# Altium schematic sheet ADC-LOGIC LEVEL CONVERTERS.SchDoc: <SPECIFIC SHEET FUNCTION>
size A3; Date: DO NOT USE, RATHER USE PROJ OPTIONS; DrawnBy: DO NOT USE, RATHER USE PROJ OPTIONS; Engineer: DO NOT USE, RATHER USE PROJ OPTIONS; Organization: DO NOT USE, RATHER USE PROJ OPTIONS; DocumentNumber: 8; Revision: DO NOT USE, RATHER USE PROJ OPTIONS; SheetNumber: 8; SheetTotal: 12; SCH_Sheet_Filename: ADC-LOGIC LEVEL CONVERTERS.SchDoc; CurrentTime: DO NOT USE, RATHER USE PROJ OPTIONS; Time: DO NOT USE, RATHER USE PROJ OPTIONS; DocumentFullPathAndName: DO NOT USE, RATHER USE PROJ OPTIONS; DocumentName: DO NOT USE, RATHER USE PROJ OPTIONS; ModifiedDate: DO NOT USE, RATHER USE PROJ OPTIONS; ImagePath: DO NOT USE, RATHER USE PROJ OPTIONS
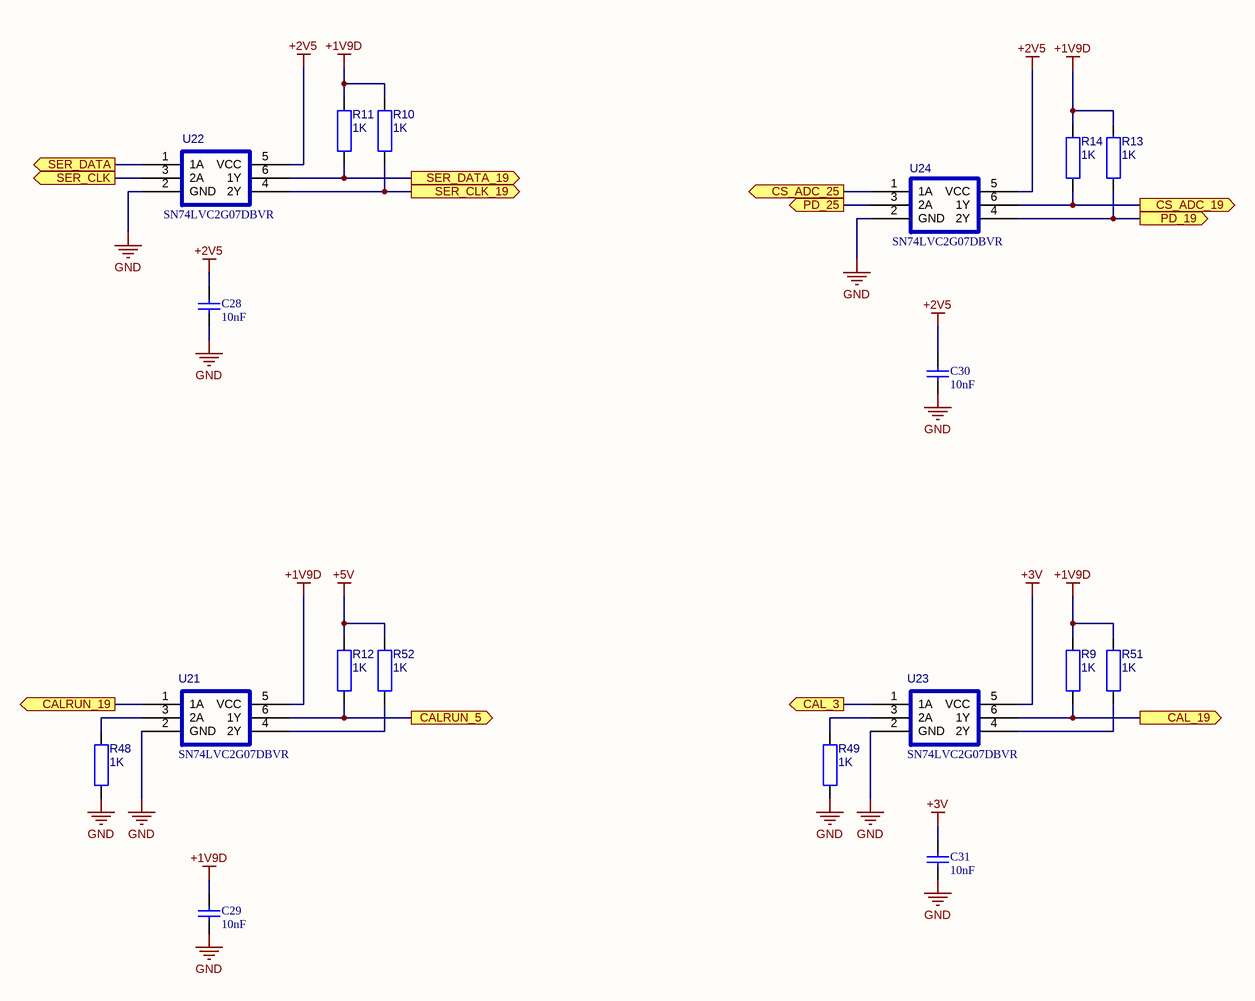
[diagram p0: ADC-LOGIC LEVEL CONVERTERS.SchDoc]

## Parts
C28  value 10nF  [CAPC1005X55N]  (hidden comment: Capacitor 0402 SMD)
C29  value 10nF  [CAPC1005X55N]  (hidden comment: Capacitor 0402 SMD)
C30  value 10nF  [CAPC1005X55N]  (hidden comment: Capacitor 0402 SMD)
C31  value 10nF  [CAPC1005X55N]  (hidden comment: Capacitor 0402 SMD)
R9  1K  [0603]
R10  1K  [0603]
R11  1K  [0603]
R12  1K  [0603]
R13  1K  [0603]
R14  1K  [0603]
R48  1K  [0603]
R49  1K  [0603]
R51  1K  [0603]
R52  1K  [0603]
U21  SN74LVC2G07DBVR  [SOT95P280X145-6N]
U22  SN74LVC2G07DBVR  [SOT95P280X145-6N]
U23  SN74LVC2G07DBVR  [SOT95P280X145-6N]
U24  SN74LVC2G07DBVR  [SOT95P280X145-6N]

## Ports
CAL_3 (out), CAL_19 (out), CALRUN_5 (out), CALRUN_19 (out), CS_ADC_19 (out), CS_ADC_25 (out), PD_19 (out), PD_25 (out), SER_CLK (out), SER_CLK_19 (out), SER_DATA (out), SER_DATA_19 (out)

## Nets
+1V9D: C29.2 R9.1 R10.1 R11.1 R13.1 R14.1 R51.1 U21.5(VCC)
+2V5: C28.2 C30.2 U22.5(VCC) U24.5(VCC)
+3V: C31.2 U23.5(VCC)
+5V: R12.1 R52.1
GND: C28.1 C29.1 C30.1 C31.1 R48.2 R49.2 U21.2(GND) U22.2(GND) U23.2(GND) U24.2(GND)
CAL_3: U23.1(1A) ; port CAL_3
CAL_19: R9.2 U23.6(1Y) ; port CAL_19
CALRUN_5: R12.2 U21.6(1Y) ; port CALRUN_5
CALRUN_19: U21.1(1A) ; port CALRUN_19
CS_ADC_19: R14.2 U24.6(1Y) ; port CS_ADC_19
CS_ADC_25: U24.1(1A) ; port CS_ADC_25
PD_19: R13.2 U24.4(2Y) ; port PD_19
PD_25: U24.3(2A) ; port PD_25
SER_CLK: U22.3(2A) ; port SER_CLK
SER_CLK_19: R10.2 U22.4(2Y) ; port SER_CLK_19
SER_DATA: U22.1(1A) ; port SER_DATA
SER_DATA_19: R11.2 U22.6(1Y) ; port SER_DATA_19
NetR48_1: R48.1 U21.3(2A)
NetR49_1: R49.1 U23.3(2A)
NetR51_2: R51.2 U23.4(2Y)
NetR52_2: R52.2 U21.4(2Y)

## Notes on the sheet
- 2009   THIS DOCUMENT IS THE PROPERTY OF THE OWNER, AND MAY NOT BE COPIED OR USED FOR ANY PURPOSE OTHER THAN THAT FOR WHICH IT IS SUPPLIED WITHOUT PERMISSION IN WRITING FROM THE OWNER.
- C
- DATESTAMP OF THIS PRINT
- DRAWN BY:
- DOCUMENT NUMBER:
- SCHEMATIC FILENAME:
- PCB FILENAME:
- ENGINEER:
- APPROVED:
- CIRCUIT DIAGRAM
- DATE
- SHEET
- REVISION
- OF

## Library data of the parts
C28-C31 = cap0402: Created_By: EDA-ASA; Checked_By: *; Checked_Date: *; HelpURL: *; Supplier1: *; Supplier2: *; Unit_Cost: *; MOQ: *; Leadtime: *; Inventory_Stock: *; Tolerance: *; Wattage: *; Package: 0402; ComponentLinked1Description: *; ComponentLinked1URL: *; ComponentLinked2Description: *; ComponentLinked2URL: *; ComponentLinked3Description: *; ComponentLinked3URL: *; ComponentLinked4Description: *; ComponentLinked4URL: *
R9-R14 R48 R49 R51 R52 = RES-0805: RESISTOR SMD 0805; Checked_By: NN; Manufacturer: *; Manufacturer_PN: *; Created_By: *; Checked_Date: 5-08-2009; HelpURL: *; ComponentLink1Description: Footprint Detail; ComponentLink1URL: *; ComponentLink2Description: Application Note; ComponentLink2URL: *; ComponentLink3Description: Layout Guidelines; ComponentLink3URL: *; ComponentLink4Description: Technology Reference; ComponentLink4URL: *; Supplier1: *; Supplier2: *; Unit_Cost: *; MOQ: *; Leadtime: *; Inventory_Stock: *; Tolerance: *; Wattage: *; Voltage: *; Package: 0805; ComponentLink5Description: Production Detail; ComponentLink5URL: *; Note: *; Stock Code: *; Value: 1K
U21-U24 = SN74LVC2G07DBVR: Dual Buffer/Driver with open-drain output; Manufacturer: TI; Created_By: IN; Manufacturer_PN: SN74LVC2G07DBVR; Checked_By: *; Checked_Date: *; HelpURL: X:\Datasheets\By_Manufacturer\TI\sn74lvc2g07.pdf; ComponentLink1Description: Footprint Detail; ComponentLink2Description: Application Note; ComponentLink2URL: *; ComponentLink3Description: Layout Guidelines; ComponentLink3URL: *; ComponentLink4Description: Technology Reference; ComponentLink4URL: *; Supplier1: *; Supplier2: *; Unit_Cost: *; MOQ: *; Leadtime: *; Inventory_Stock: *; Tolerance: *; Wattage: *; Voltage: *; Package: *; ComponentLink5Description: Production Detail; ComponentLink5URL: *; Note: *; Stock Code: *